# Altium schematic sheet Decoupling_&_FPGA_PowerDistrZynq 7010.SchDoc
size A4; SheetNumber: 1; SheetTotal: 4
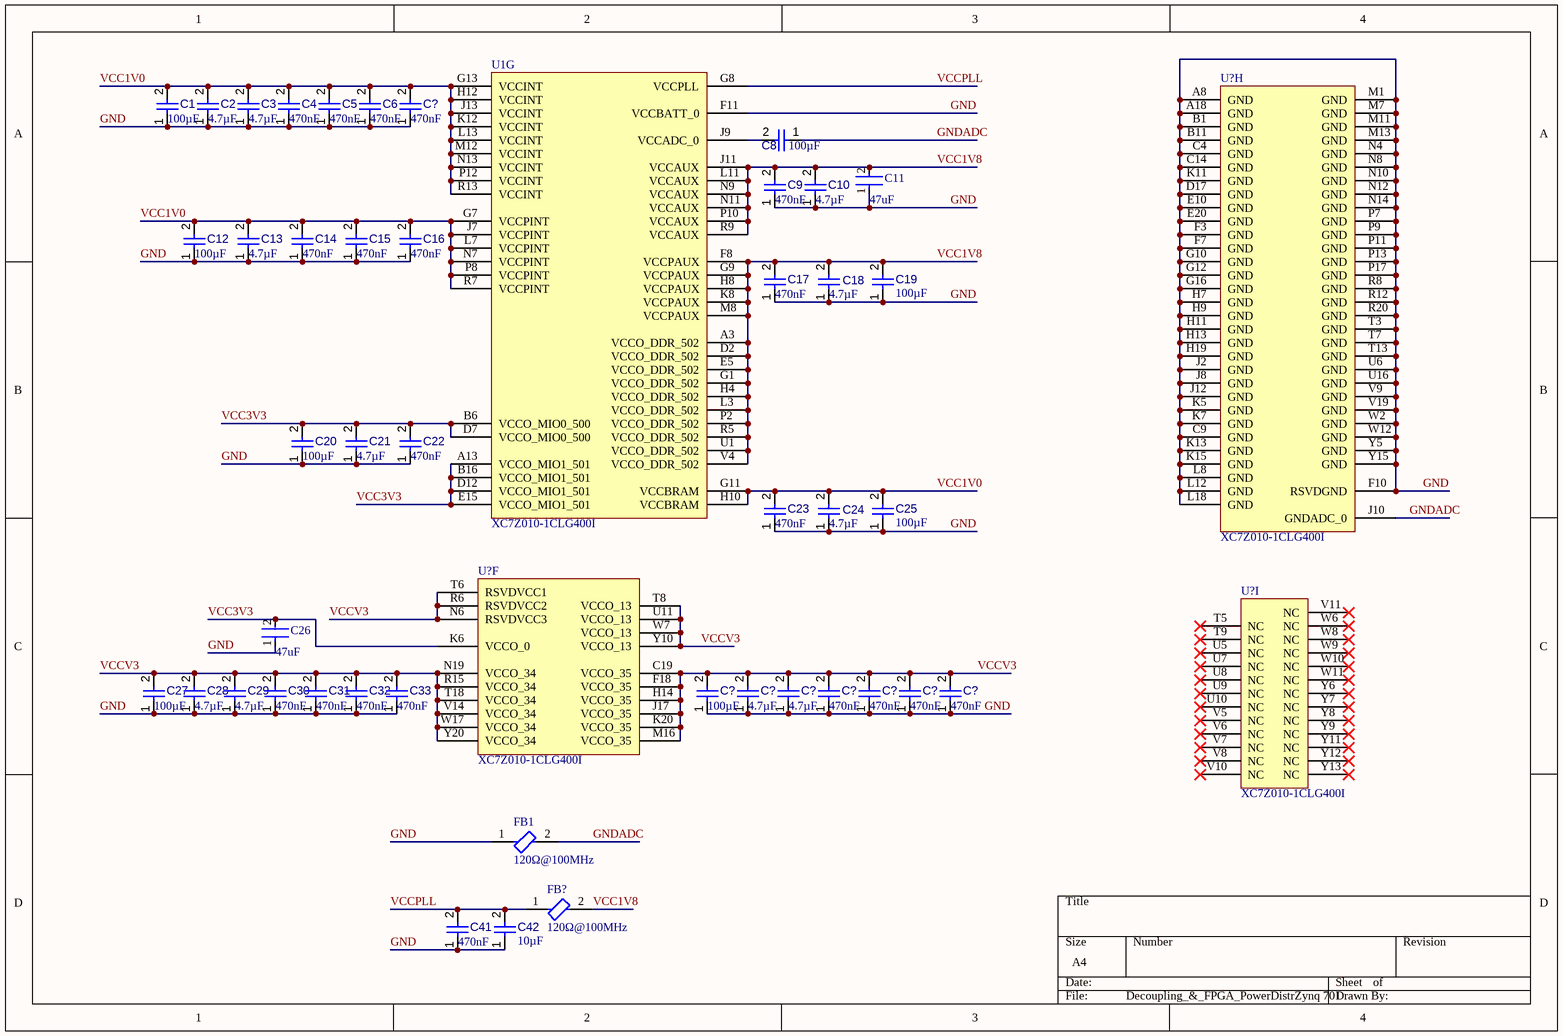
[diagram p0: Decoupling_&_FPGA_PowerDistrZynq 7010.SchDoc]

## Parts
(Parts that share a designator on the sheet are numbered #1, #2 ... from top to bottom, then left to right.)
C1  value 100µF  [CAPC3216X190X55LL30T25]  (hidden comment: Capacitor 100 uF +/- 20% 6.3 V 1206)
C2  value 4.7µF  [CAPC0805(2012)145_L]  (hidden comment: Capacitor 4.7µF +/-40% 25V 0805)
C3  value 4.7µF  [CAPC0805(2012)145_L]  (hidden comment: Capacitor 4.7µF +/-40% 25V 0805)
C4  value 470nF  [CAPC0402(1005)60_L]  (hidden comment: Capacitor 470nF +/-40% 10V 0402)
C5  value 470nF  [CAPC0402(1005)60_L]  (hidden comment: Capacitor 470nF +/-40% 10V 0402)
C6  value 470nF  [CAPC0402(1005)60_L]  (hidden comment: Capacitor 470nF +/-40% 10V 0402)
C8  value 100µF  [CAPC3216X190X55LL30T25]  (hidden comment: Capacitor 100 uF +/- 20% 6.3 V 1206)
C9  value 470nF  [CAPC0402(1005)60_L]  (hidden comment: Capacitor 470nF +/-40% 10V 0402)
C10  value 4.7µF  [CAPC0805(2012)145_L]  (hidden comment: Capacitor 4.7µF +/-40% 25V 0805)
C11  47uF  [FP-CL31-IPC_C]
C12  value 100µF  [CAPC3216X190X55LL30T25]  (hidden comment: Capacitor 100 uF +/- 20% 6.3 V 1206)
C13  value 4.7µF  [CAPC0805(2012)145_L]  (hidden comment: Capacitor 4.7µF +/-40% 25V 0805)
C14  value 470nF  [CAPC0402(1005)60_L]  (hidden comment: Capacitor 470nF +/-40% 10V 0402)
C15  value 470nF  [CAPC0402(1005)60_L]  (hidden comment: Capacitor 470nF +/-40% 10V 0402)
C16  value 470nF  [CAPC0402(1005)60_L]  (hidden comment: Capacitor 470nF +/-40% 10V 0402)
C17  value 470nF  [CAPC0402(1005)60_L]  (hidden comment: Capacitor 470nF +/-40% 10V 0402)
C18  value 4.7µF  [CAPC0805(2012)145_L]  (hidden comment: Capacitor 4.7µF +/-40% 25V 0805)
C19  value 100µF  [CAPC3216X190X55LL30T25]  (hidden comment: Capacitor 100 uF +/- 20% 6.3 V 1206)
C20  value 100µF  [CAPC3216X190X55LL30T25]  (hidden comment: Capacitor 100 uF +/- 20% 6.3 V 1206)
C21  value 4.7µF  [CAPC0805(2012)145_L]  (hidden comment: Capacitor 4.7µF +/-40% 25V 0805)
C22  value 470nF  [CAPC0402(1005)60_L]  (hidden comment: Capacitor 470nF +/-40% 10V 0402)
C23  value 470nF  [CAPC0402(1005)60_L]  (hidden comment: Capacitor 470nF +/-40% 10V 0402)
C24  value 4.7µF  [CAPC0805(2012)145_L]  (hidden comment: Capacitor 4.7µF +/-40% 25V 0805)
C25  value 100µF  [CAPC3216X190X55LL30T25]  (hidden comment: Capacitor 100 uF +/- 20% 6.3 V 1206)
C26  47uF  [FP-CL31-IPC_C]
C27  value 100µF  [CAPC3216X190X55LL30T25]  (hidden comment: Capacitor 100 uF +/- 20% 6.3 V 1206)
C28  value 4.7µF  [CAPC0805(2012)145_L]  (hidden comment: Capacitor 4.7µF +/-40% 25V 0805)
C29  value 4.7µF  [CAPC0805(2012)145_L]  (hidden comment: Capacitor 4.7µF +/-40% 25V 0805)
C30  value 470nF  [CAPC0402(1005)60_L]  (hidden comment: Capacitor 470nF +/-40% 10V 0402)
C31  value 470nF  [CAPC0402(1005)60_L]  (hidden comment: Capacitor 470nF +/-40% 10V 0402)
C32  value 470nF  [CAPC0402(1005)60_L]  (hidden comment: Capacitor 470nF +/-40% 10V 0402)
C33  value 470nF  [CAPC0402(1005)60_L]  (hidden comment: Capacitor 470nF +/-40% 10V 0402)
C41  value 470nF  [CAPC0402(1005)60_L]  (hidden comment: Capacitor 470nF +/-40% 10V 0402)
C42  value 10µF  [CAPC0603(1608)100_L]  (hidden comment: Capacitor 10µF +/-20% 10V 0603)
C?#1  value 470nF  [CAPC0402(1005)60_L]  (hidden comment: Capacitor 470nF +/-40% 10V 0402)
C?#2  value 100µF  [CAPC3216X190X55LL30T25]  (hidden comment: Capacitor 100 uF +/- 20% 6.3 V 1206)
C?#3  value 4.7µF  [CAPC0805(2012)145_L]  (hidden comment: Capacitor 4.7µF +/-40% 25V 0805)
C?#4  value 4.7µF  [CAPC0805(2012)145_L]  (hidden comment: Capacitor 4.7µF +/-40% 25V 0805)
C?#5  value 470nF  [CAPC0402(1005)60_L]  (hidden comment: Capacitor 470nF +/-40% 10V 0402)
C?#6  value 470nF  [CAPC0402(1005)60_L]  (hidden comment: Capacitor 470nF +/-40% 10V 0402)
C?#7  value 470nF  [CAPC0402(1005)60_L]  (hidden comment: Capacitor 470nF +/-40% 10V 0402)
C?#8  value 470nF  [CAPC0402(1005)60_L]  (hidden comment: Capacitor 470nF +/-40% 10V 0402)
FB1  120Ω@100MHz  [FP-MMZ2012-IPC_B]
FB?  120Ω@100MHz  [FP-MMZ2012-IPC_B]
U1  XC7Z010-1CLG400I  [CLG400]  (part G of 9)
U?#1  XC7Z010-1CLG400I  [CLG400]  (part H of 9)
U?#2  XC7Z010-1CLG400I  [CLG400]  (part F of 9)
U?#3  XC7Z010-1CLG400I  [CLG400]  (part I of 9)

## Nets
GND: C1.1 C2.1 C3.1 C4.1 C5.1 C6.1 C9.1 C10.1 C11.1 C12.1 C13.1 C14.1 C15.1 C16.1 C17.1 C18.1 C19.1 C20.1 C21.1 C22.1 C23.1 C24.1 C25.1 C26.1 C27.1 C28.1 C29.1 C30.1 C31.1 C32.1 C33.1 C41.1 C42.1 C?#1.1 C?#2.1 C?#3.1 C?#4.1 C?#5.1 C?#6.1 C?#7.1 C?#8.1 FB1.1 U1.F11(VCCBATT_0) U?#1.A8(GND) U?#1.A18(GND) U?#1.B1(GND) U?#1.B11(GND) U?#1.C4(GND) U?#1.C9(GND) U?#1.C14(GND) U?#1.D17(GND) U?#1.E10(GND) U?#1.E20(GND) U?#1.F3(GND) U?#1.F7(GND) U?#1.F10(RSVDGND) U?#1.G10(GND) U?#1.G12(GND) U?#1.G16(GND) U?#1.H7(GND) U?#1.H9(GND) U?#1.H11(GND) U?#1.H13(GND) U?#1.H19(GND) U?#1.J2(GND) U?#1.J8(GND) U?#1.J12(GND) U?#1.K5(GND) U?#1.K7(GND) U?#1.K11(GND) U?#1.K13(GND) U?#1.K15(GND) U?#1.L8(GND) U?#1.L12(GND) U?#1.L18(GND) U?#1.M1(GND) U?#1.M7(GND) U?#1.M11(GND) U?#1.M13(GND) U?#1.N4(GND) U?#1.N8(GND) U?#1.N10(GND) U?#1.N12(GND) U?#1.N14(GND) U?#1.P7(GND) U?#1.P9(GND) U?#1.P11(GND) U?#1.P13(GND) U?#1.P17(GND) U?#1.R8(GND) U?#1.R12(GND) U?#1.R20(GND) U?#1.T3(GND) U?#1.T7(GND) U?#1.T13(GND) U?#1.U6(GND) U?#1.U16(GND) U?#1.V9(GND) U?#1.V19(GND) U?#1.W2(GND) U?#1.W12(GND) U?#1.Y5(GND) U?#1.Y15(GND)
GNDADC: C8.1 FB1.2 U?#1.J10(GNDADC_0)
VCC1V0: C1.2 C2.2 C3.2 C4.2 C5.2 C6.2 C12.2 C13.2 C14.2 C15.2 C16.2 C23.2 C24.2 C25.2 C?#1.2 U1.G7(VCCPINT) U1.G11(VCCBRAM) U1.G13(VCCINT) U1.H10(VCCBRAM) U1.H12(VCCINT) U1.J7(VCCPINT) U1.J13(VCCINT) U1.K12(VCCINT) U1.L7(VCCPINT) U1.L13(VCCINT) U1.M12(VCCINT) U1.N7(VCCPINT) U1.N13(VCCINT) U1.P8(VCCPINT) U1.P12(VCCINT) U1.R7(VCCPINT) U1.R13(VCCINT)
VCC1V8: C9.2 C10.2 C11.2 C17.2 C18.2 C19.2 FB?.2 U1.A3(VCCO_DDR_502) U1.D2(VCCO_DDR_502) U1.E5(VCCO_DDR_502) U1.F8(VCCPAUX) U1.G1(VCCO_DDR_502) U1.G9(VCCPAUX) U1.H4(VCCO_DDR_502) U1.H8(VCCPAUX) U1.J11(VCCAUX) U1.K8(VCCPAUX) U1.L3(VCCO_DDR_502) U1.L11(VCCAUX) U1.M8(VCCPAUX) U1.N9(VCCAUX) U1.N11(VCCAUX) U1.P2(VCCO_DDR_502) U1.P10(VCCAUX) U1.R5(VCCO_DDR_502) U1.R9(VCCAUX) U1.U1(VCCO_DDR_502) U1.V4(VCCO_DDR_502)
VCC3V3: C20.2 C21.2 C22.2 C26.2 U1.A13(VCCO_MIO1_501) U1.B6(VCCO_MIO0_500) U1.B16(VCCO_MIO1_501) U1.D7(VCCO_MIO0_500) U1.D12(VCCO_MIO1_501) U1.E15(VCCO_MIO1_501) U?#2.K6(VCCO_0)
VCCPLL: C41.2 C42.2 FB?.1 U1.G8(VCCPLL)
VCCV3: C27.2 C28.2 C29.2 C30.2 C31.2 C32.2 C33.2 C?#2.2 C?#3.2 C?#4.2 C?#5.2 C?#6.2 C?#7.2 C?#8.2 U?#2.C19(VCCO_35) U?#2.F18(VCCO_35) U?#2.H14(VCCO_35) U?#2.J17(VCCO_35) U?#2.K20(VCCO_35) U?#2.M16(VCCO_35) U?#2.N6(RSVDVCC3) U?#2.N19(VCCO_34) U?#2.R6(RSVDVCC2) U?#2.R15(VCCO_34) U?#2.T6(RSVDVCC1) U?#2.T8(VCCO_13) U?#2.T18(VCCO_34) U?#2.U11(VCCO_13) U?#2.V14(VCCO_34) U?#2.W7(VCCO_13) U?#2.W17(VCCO_34) U?#2.Y10(VCCO_13) U?#2.Y20(VCCO_34)
NetC8_2: C8.2 U1.J9(VCCADC_0)

Not connected (* = marked no-connect by the designer): U?#3 T5(NC)* T9(NC)* U5(NC)* U7(NC)* U8(NC)* U9(NC)* U10(NC)* V5(NC)* V6(NC)* V7(NC)* V8(NC)* V10(NC)* V11(NC)* W6(NC)* W8(NC)* W9(NC)* W10(NC)* W11(NC)* Y6(NC)* Y7(NC)* Y8(NC)* Y9(NC)* Y11(NC)* Y12(NC)* Y13(NC)*

## Library data of the parts
C1 C8 C12 C19 C20 C25 C27 C?#2 = CMP-001-00019-6: Chip Capacitor, 100 uF, +/- 20%, 6.3 V, 1206 (3216 Metric); Voltage Rating: 6.3V; Capacitor Type: Ceramic; Tolerance: 20%; Pins: 2; Case/Package: 1206; Max Operating Temperature: 85°C; RoHS Compliant: True; Mounting Technology: SM; Min Operating Temperature: -55°C
C2 C3 C10 C13 C18 C21 C24 C28 C29 C?#3 C?#4 = CMP-001-00080-4: Chip Capacitor, 4.7µF +/-40%, 25V, 0805, Thickness 1.45 mm; Tolerance: 20%; Voltage Rating: 25V; Min Operating Temperature: -55°C; Max Operating Temperature: 85°C; Pins: 2; Mounting Technology: SMT; Case/Package: 0805
C4-C6 C9 C14-C17 C22 C23 C30-C33 C41 C?#1 C?#5-C?#8 = CMP-001-00060-4: Chip Capacitor, 470nF +/-40%, 10V, 0402, Thickness 0.6 mm; Tolerance: 20%; Max Operating Temperature: 85°C; Case/Package: 0402; Voltage Rating: 10V; Min Operating Temperature: -55°C; Mounting Technology: SMT; Pins: 2
C11 C26 = CMP-13271-001061-1: Cap Ceramic 47uF 6.3V X5R ±20% SMD 1206 +85°C Embossed T/R; Tolerance: 20%; Capacitance: 47uF; Depth: 1.6mm; Case Code (Imperial): 1206; Voltage Rating: 6.3V; Width: 0.063inch; Max Operating Temperature: 85°C; Case/Package: 1206; Dielectric: X5R; Length: 3.2mm; Contact Plating: Tin; Height: 1.6mm; Packaging: Tape and Reel; Case Code (Metric): 3216; Voltage: 6.3V; Min Operating Temperature: -55°C; Mount: Surface Mount; Thickness: 0.071inch; Package Quantity: 1; Material: Ceramic; Radiation Hardening: No
C42 = CMP-001-00075-4: Chip Capacitor, 10µF +/-20%, 10V, 0603, Thickness 1 mm; Tolerance: 10%; Voltage Rating: 10V; Max Operating Temperature: 85°C; Pins: 2; Case/Package: 0603; Mounting Technology: SMT; Min Operating Temperature: -55°C
FB1 FB? = CMP-08257-000164-1: Signal Line Ferrite Bead 600Ω @ 100Mhz 500mA DCR 300mΩ SMD 0805; DC Resistance (DCR): 300mR; Impedance: 600R; Tolerance: 25%; Number of Pins: 2; Case Code (Imperial): 0805; Series: MMZ; Mount: Surface Mount; Depth: 1.25mm; Case/Package: 0805; REACH SVHC: No SVHC; RoHS Compliant: Yes; Width: 0.049inch; Current Rating: 500mA; Package Quantity: 4000; Core Material: Ferrite; Max DC Current: 500mA; Case Code (Metric): 2012; Height: 0.041inch; Packaging: Tape and Reel; Length: 0.079inch; Lead Free: Lead Free
U1 U?#1-U?#3 = CMP-0363-00008-3: 667 MHz Zynq™-7000 AP SoC, 130 PS I/O, 100 FPGA I/O, 400-Ball BGA, Speed Grade 1, Industrial Grade, Pb-Free; Speed Grade: -1; LUTs: 17600; Extensible Block RAM (# 36Kb Blocks): 240 KB (60); Flip Flops: 35200; PartNumber: XC7Z010-1CLG400I; Mounting Technology: Surface Mount; ComponentLink5URL: http://www.xilinx.com/support/documentation/user_guides/ug865-Zynq-7000-Pkg-Pinout.pdf; ComponentLink3URL: http://www.xilinx.com/support/documentation/data_sheets/ds187-XC7Z010-XC7Z020-Data-Sheet.pdf; PackageVersion: Rev 1.1, 09/2012; ComponentLink2Description: Package Specification; ComponentLink4Description: Package File; ComponentLink2URL: http://www.xilinx.com/support/documentation/user_guides/ug865-Zynq-7000-Pkg-Pinout.pdf; ComponentLink3Description: DC and AC Switching Characteristics; ComponentLink6Description: PCB and Layout Guide; ComponentLink4URL: http://www.xilinx.com/support/packagefiles/z7packages/xc7z010clg400pkg.txt; ComponentLink1URL: http://www.xilinx.com/support/documentation/data_sheets/ds190-Zynq-7000-Overview.pdf; Generic Part Number: XC7Z010; PackageReference: CLG400; ComponentLink1Description: Datasheet; RoHS: Pb-Free; ComponentLink6URL: http://www.xilinx.com/support/documentation/user_guides/ug483_7Series_PCB.pdf; DatasheetVersion: v1.2; PackageDescription: Wire-Bond Chip-Scale BGA, Body 17 x 17 mm, 0.8 mm Pitch; ComponentLink5Description: Packaging and Pinout; Code_JEDEC: MO-275-MMAA-1